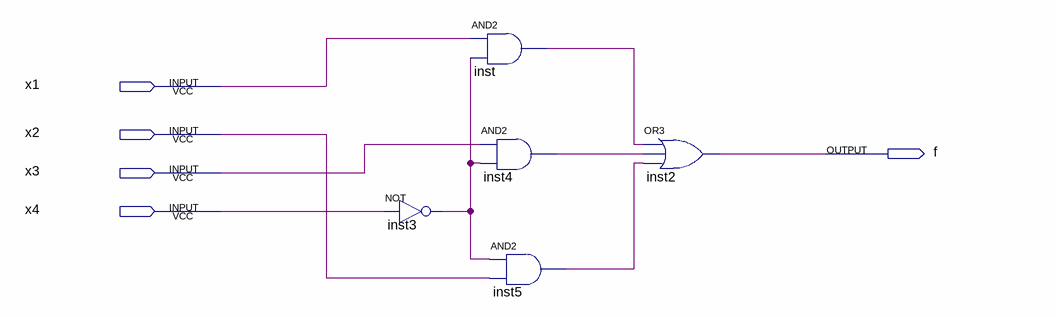
[diagram p0: schematic sheet]
// Quartus schematic scheme.bdf as structural Verilog: 5 symbols, 5 pins
module scheme (
  input  x1,
  input  x2,
  input  x3,
  input  x4,
  output f
);

  wire inst3_out, inst4_out, inst5_out, inst_out;

  not inst3 (inst3_out, x4);
  and inst (inst_out, x1, inst3_out);
  and inst4 (inst4_out, x3, inst3_out);
  and inst5 (inst5_out, inst3_out, x2);
  or inst2 (f, inst_out, inst4_out, inst5_out);
endmodule
